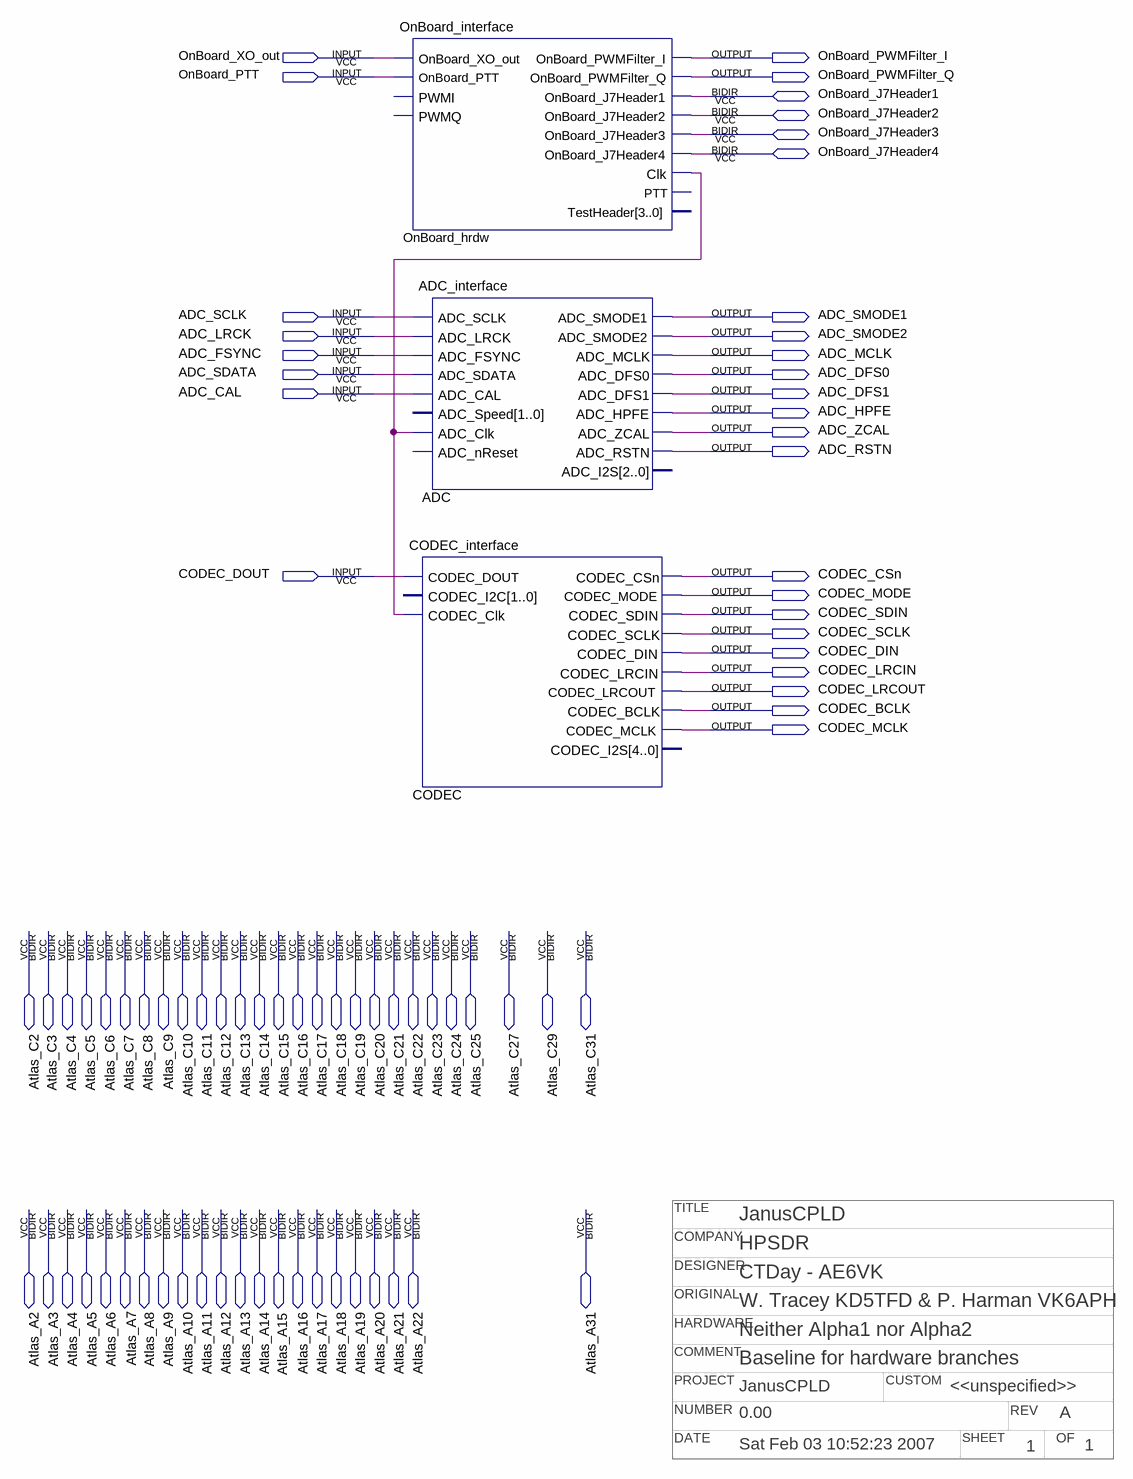
[diagram p0: schematic sheet]
// Quartus schematic JanusCPLD.bdf as structural Verilog: 3 symbols, 80 pins
// Title block: TITLE: JanusCPLD; COMPANY: HPSDR; DESIGNER: CTDay - AE6VK; NUMBER: 0.00; REV: A; DATE: Sat Feb 03 10:52:23 2007; SHEET: 1; OF: 1; ORIGINAL: W. Tracey KD5TFD & P. Harman VK6APH; HARDWARE: Neither Alpha1 nor Alpha2; COMMENT: Baseline for hardware branches; PROJECT: JanusCPLD; CUSTOM: <<unspecified>>
module JanusCPLD (
  input  OnBoard_XO_out,
  input  OnBoard_PTT,
  input  ADC_SCLK,
  input  ADC_LRCK,
  input  ADC_FSYNC,
  input  ADC_SDATA,
  input  ADC_CAL,
  input  CODEC_DOUT,
  inout  OnBoard_J7Header1,
  inout  OnBoard_J7Header2,
  inout  OnBoard_J7Header3,
  inout  OnBoard_J7Header4,
  inout  Atlas_C2,
  inout  Atlas_C3,
  inout  Atlas_C4,
  inout  Atlas_C5,
  inout  Atlas_C6,
  inout  Atlas_C7,
  inout  Atlas_C8,
  inout  Atlas_C9,
  inout  Atlas_C10,
  inout  Atlas_C11,
  inout  Atlas_C12,
  inout  Atlas_C13,
  inout  Atlas_C14,
  inout  Atlas_C15,
  inout  Atlas_C16,
  inout  Atlas_C17,
  inout  Atlas_C18,
  inout  Atlas_C19,
  inout  Atlas_C20,
  inout  Atlas_C21,
  inout  Atlas_C22,
  inout  Atlas_C23,
  inout  Atlas_C24,
  inout  Atlas_C25,
  inout  Atlas_C27,
  inout  Atlas_C29,
  inout  Atlas_C31,
  inout  Atlas_A2,
  inout  Atlas_A3,
  inout  Atlas_A4,
  inout  Atlas_A5,
  inout  Atlas_A6,
  inout  Atlas_A7,
  inout  Atlas_A8,
  inout  Atlas_A9,
  inout  Atlas_A10,
  inout  Atlas_A11,
  inout  Atlas_A12,
  inout  Atlas_A13,
  inout  Atlas_A14,
  inout  Atlas_A15,
  inout  Atlas_A16,
  inout  Atlas_A17,
  inout  Atlas_A18,
  inout  Atlas_A19,
  inout  Atlas_A20,
  inout  Atlas_A21,
  inout  Atlas_A22,
  inout  Atlas_A31,
  output OnBoard_PWMFilter_I,
  output OnBoard_PWMFilter_Q,
  output ADC_SMODE1,
  output ADC_SMODE2,
  output ADC_MCLK,
  output ADC_DFS0,
  output ADC_DFS1,
  output ADC_HPFE,
  output ADC_ZCAL,
  output ADC_RSTN,
  output CODEC_CSn,
  output CODEC_MODE,
  output CODEC_SDIN,
  output CODEC_SCLK,
  output CODEC_DIN,
  output CODEC_LRCIN,
  output CODEC_LRCOUT,
  output CODEC_BCLK,
  output CODEC_MCLK
);

  wire OnBoard_hrdw_clk;

  OnBoard_interface OnBoard_hrdw (
    .OnBoard_XO_out(OnBoard_XO_out), .OnBoard_PTT(OnBoard_PTT), .OnBoard_PWMFilter_I(OnBoard_PWMFilter_I),
    .OnBoard_PWMFilter_Q(OnBoard_PWMFilter_Q), .Clk(OnBoard_hrdw_clk), .OnBoard_J7Header1(OnBoard_J7Header1),
    .OnBoard_J7Header2(OnBoard_J7Header2), .OnBoard_J7Header3(OnBoard_J7Header3),
    .OnBoard_J7Header4(OnBoard_J7Header4));  // open: PWMI, PWMQ, PTT, TestHeader
  ADC_interface ADC (
    .ADC_SCLK(ADC_SCLK), .ADC_LRCK(ADC_LRCK), .ADC_FSYNC(ADC_FSYNC), .ADC_SDATA(ADC_SDATA),
    .ADC_CAL(ADC_CAL), .ADC_Clk(OnBoard_hrdw_clk), .ADC_SMODE1(ADC_SMODE1), .ADC_SMODE2(ADC_SMODE2),
    .ADC_MCLK(ADC_MCLK), .ADC_DFS0(ADC_DFS0), .ADC_DFS1(ADC_DFS1), .ADC_HPFE(ADC_HPFE), .ADC_ZCAL(ADC_ZCAL),
    .ADC_RSTN(ADC_RSTN));  // open: ADC_Speed, ADC_nReset, ADC_I2S
  CODEC_interface CODEC (
    .CODEC_DOUT(CODEC_DOUT), .CODEC_Clk(OnBoard_hrdw_clk), .CODEC_CSn(CODEC_CSn), .CODEC_MODE(CODEC_MODE),
    .CODEC_SDIN(CODEC_SDIN), .CODEC_SCLK(CODEC_SCLK), .CODEC_DIN(CODEC_DIN), .CODEC_LRCIN(CODEC_LRCIN),
    .CODEC_LRCOUT(CODEC_LRCOUT), .CODEC_BCLK(CODEC_BCLK), .CODEC_MCLK(CODEC_MCLK));  // open: CODEC_I2C, CODEC_I2S
endmodule
